# EAGLE design ASM2026 (EAGLE 6.3)
DATABASE: ./../../../../../Components/TinyCircuits_Part_Database.txt
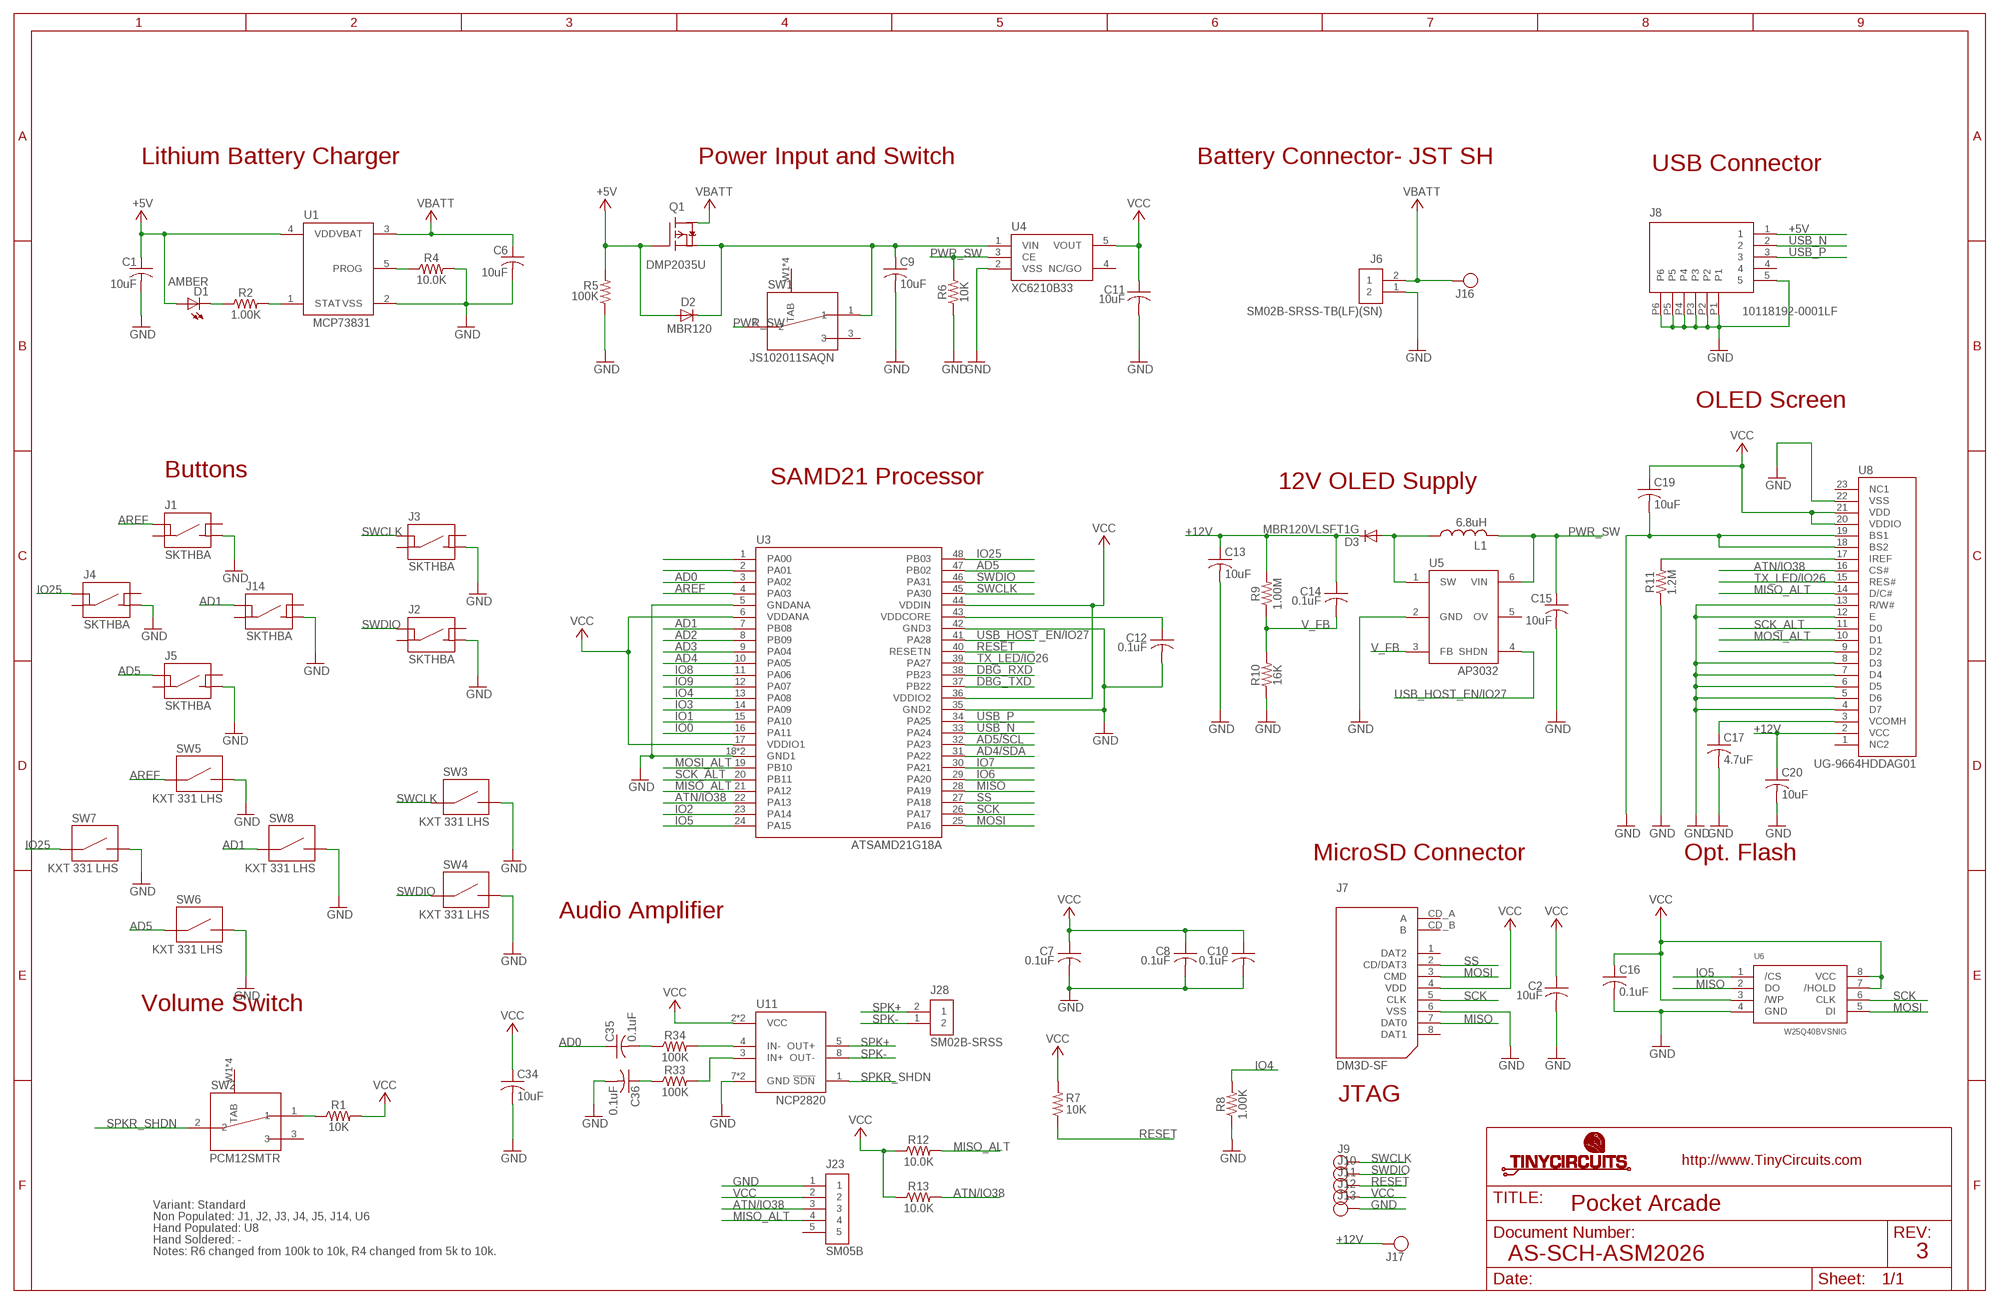
[diagram p0: schematic, sheet 1]

## Parts
C1  10uF  AS-ITM-00002  [C0603]
C2  10uF  AS-ITM-00002  [C0603]
C6  10uF  AS-ITM-00002  [C0603]
C7  0.1uF  AS-ITM-00008  [C0402]
C8  0.1uF  AS-ITM-00008  [C0402]
C9  10uF  AS-ITM-00002  [C0603]
C10  0.1uF  AS-ITM-00008  [C0402]
C11  10uF  AS-ITM-00002  [C0603]
C12  0.1uF  AS-ITM-00008  [C0402]
C13  10uF  AS-ITM-00045  [C0805]
C14  0.1uF  AS-ITM-00008  [C0402]
C15  10uF  AS-ITM-00002  [C0603]
C16  0.1uF  AS-ITM-00008  [C0402]
C17  4.7uF  AS-ITM-00232  [1206_CAP_TANT]
C19  10uF  AS-ITM-00002  [C0603]
C20  10uF  AS-ITM-00045  [C0805]
C34  10uF  AS-ITM-00002  [C0603]
C35  0.1uF  AS-ITM-00008  [C0402]
C36  0.1uF  AS-ITM-00008  [C0402]
D1  AMBER  AS-ITM-00026  [LNJ_LED]
D2  MBR120  AS-ITM-00111  [SOD-123FL]
D3  MBR120VLSFT1G  AS-ITM-00111  [SOD-123FL]
J1  SKTHBA  AS-ITM-00369  [SKTHBA_TACT]
J2  SKTHBA  AS-ITM-00369  [SKTHBA_TACT]
J3  SKTHBA  AS-ITM-00369  [SKTHBA_TACT]
J4  SKTHBA  AS-ITM-00369  [SKTHBA_TACT]
J5  SKTHBA  AS-ITM-00369  [SKTHBA_TACT]
J6  SM02B-SRSS-TB(LF)(SN)  AS-ITM-00231  [JST_SH_2X1]
J7  DM3D-SF  AS-ITM-00047  [SD_CARD]
J8  10118192-0001LF  AS-ITM-00021A  [MICRO_USB_ALT]
J9  TEST_POINT  [TEST_POINT_1MM]
J10  TEST_POINT  [TEST_POINT_1MM]
J11  TEST_POINT  [TEST_POINT_1MM]
J12  TEST_POINT  [TEST_POINT_1MM]
J13  TEST_POINT  [TEST_POINT_1MM]
J14  SKTHBA  AS-ITM-00369  [SKTHBA_TACT]
J16  TEST_POINT  [TEST_POINT_1MM]
J17  TEST_POINT  [TEST_POINT_1MM]
J23  SM05B  AS-ITM-00340  [JST_SH_5X1]
J28  SM02B-SRSS  AS-ITM-00231  [JST_SH_2X1]
L1  6.8uH  AS-ITM-00320  [R0805]
Q1  DMP2035U  AS-ITM-00024A  [SOT23A]
R1  10K  AS-ITM-00032  [0402]
R2  1.00K  AS-ITM-00003  [0402]
R4  10.0K  AS-ITM-00032  [0402]
R5  100K  AS-ITM-00004  [0402]
R6  10K  AS-ITM-00032  [0402]
R7  10K  AS-ITM-00032  [0402]
R8  1.00K  AS-ITM-00003  [0402]
R9  1.00M  AS-ITM-00005  [0402]
R10  16K  AS-ITM-00314  [0402]
R11  1.2M  AS-ITM-00280  [0402]
R12  10.0K  AS-ITM-00032  [0402]
R13  10.0K  AS-ITM-00032  [0402]
R33  100K  AS-ITM-00004  [0402]
R34  100K  AS-ITM-00004  [0402]
SW1  JS102011SAQN  AS-ITM-00220  [PCM12SMTR]
SW2  PCM12SMTR  AS-ITM-00220  [PCM12SMTR]
SW3  KXT 331 LHS  AS-ITM-003721  [KXT_LHS_1]
SW4  KXT 331 LHS  AS-ITM-003721  [KXT_LHS_1]
SW5  KXT 331 LHS  AS-ITM-003721  [KXT_LHS_1]
SW6  KXT 331 LHS  AS-ITM-003721  [KXT_LHS_1]
SW7  KXT 331 LHS  AS-ITM-003721  [KXT_LHS_1]
SW8  KXT 331 LHS  AS-ITM-003721  [KXT_LHS_1]
U1  MCP73831  AS-ITM-00136  [SOT-23]
U3  ATSAMD21G18A  AS-ITM-00273  [QFN48]
U4  XC6210B33  AS-ITM-00046  [SOT-25]
U5  AP3032  AS-ITM-00310  [SOT-23-6]
U6  W25Q40BVSNIG  AS-ITM-00238  [8-SOIC-N]
U8  UG-9664HDDAG01  AS-ITM-00158FLIPPED  [OLED_DISPLAY]
U11  NCP2820  AS-ITM-00370  [WSON-8]

## Nets
+5V: C1.1 D1.A D2.A J8.1 Q1.B(G) R5.2 U1.4(VDD)
+12V: C13.1 C14.1 C20.1 D3.C J17.P$1 R9.2 U8.2(VCC)
AD0: C35.1 U3.3(PA02)
AD1: J14.1 SW8.1 U3.7(PB08)
AD2: U3.8(PB09)
AD3: U3.9(PA04)
AD4: U3.10(PA05)
AD4/SDA: U3.31(PA22)
AD5: J5.1 SW6.1 U3.47(PB02)
AD5/SCL: U3.32(PA23)
AREF: J1.1 SW5.1 U3.4(PA03)
ATN/IO38: J23.3 R13.2 U3.22(PA13) U8.16(CS#)
DBG_RXD: U3.38(PB23)
DBG_TXD: U3.37(PB22)
GND: C1.2 C2.2 C6.2 C7.2 C8.2 C9.2 C10.2 C11.2 C12.2 C13.2 C15.2 C16.2 C17.2 C19.2 C20.2 C34.2 C36.2 J1.4 J2.4 J3.4 J4.4 J5.4 J6.1 J7.6(VSS) J8.5 J8.P1 J8.P2 J8.P3 J8.P4 J8.P5 J8.P6 J13.P$1 J14.4 J23.1 R4.2 R5.1 R6.1 R8.1 R10.1 R11.1 SW3.2 SW4.2 SW5.2 SW6.2 SW7.2 SW8.2 U1.2(VSS) U3.5(GNDANA) U3.18(GND1) U3.35(GND2) U3.42(GND3) U3.EXP(GND1) U4.2(VSS) U5.2(GND) U6.4(GND) U8.4(D7) U8.5(D6) U8.6(D5) U8.7(D4) U8.8(D3) U8.12(E) U8.13(R/W#) U8.18(BS2) U8.19(BS1) U8.22(VSS) U11.7(GND) U11.9(GND)
IO0: U3.16(PA11)
IO1: U3.15(PA10)
IO2: U3.23(PA14)
IO3: U3.14(PA09)
IO4: R8.2 U3.13(PA08)
IO5: U3.24(PA15) U6.1(/CS)
IO6: U3.29(PA20)
IO7: U3.30(PA21)
IO8: U3.11(PA06)
IO9: U3.12(PA07)
IO25: J4.1 SW7.1 U3.48(PB03)
MISO: J7.7(DAT0) U3.28(PA19) U6.2(DO)
MISO_ALT: J23.4 R12.2 U3.21(PA12) U8.14(D/C#)
MOSI: J7.3(CMD) U3.25(PA16) U6.5(DI)
MOSI_ALT: U3.19(PB10) U8.10(D1)
N$1: U3.1(PA00)
N$2: R1.1 SW2.1
N$3: U3.2(PA01)
N$5: D1.C R2.1
N$6: R4.1 U1.5(PROG)
N$7: R2.2 U1.1(STAT)
N$8: C12.1 U3.43(VDDCORE)
N$9: R11.2 U8.17(IREF)
N$12: C17.1 U8.3(VCOMH)
N$15: U8.9(D2)
N$19: D3.A L1.1 U5.1(SW)
N$46: R33.2 U11.3(IN+)
N$47: R34.2 U11.4(IN-)
N$48: C35.2 R34.1
N$49: C36.1 R33.1
PWR_SW: C15.1 L1.2 R6.2 SW1.2 U4.3(CE) U5.6(VIN)
PWR_SWITCH: C9.1 D2.C Q1.E(S) SW1.1 U4.1(VIN)
RESET: J11.P$1 R7.1 U3.40(RESETN)
SCK: J7.5(CLK) U3.26(PA17) U6.6(CLK)
SCK_ALT: U3.20(PB11) U8.11(D0)
SPK+: J28.2 U11.5(OUT+)
SPK-: J28.1 U11.8(OUT-)
SPKR_SHDN: SW2.2 U11.1(!SDN)
SS: J7.2(CD/DAT3) U3.27(PA18)
SWCLK: J3.1 J9.P$1 SW3.1 U3.45(PA30)
SWDIO: J2.1 J10.P$1 SW4.1 U3.46(PA31)
TX_LED/IO26: U3.39(PA27) U8.15(RES#)
USB_HOST_EN/IO27: U3.41(PA28) U5.4(SHDN)
USB_N: J8.2 U3.33(PA24)
USB_P: J8.3 U3.34(PA25)
V_FB: C14.2 R9.1 R10.2 U5.3(FB)
VBATT: C6.1 J6.2 J16.P$1 Q1.C(D) U1.3(VBAT)
VCC: C2.1 C7.1 C8.1 C10.1 C11.1 C16.1 C19.1 C34.1 J7.4(VDD) J12.P$1 J23.2 R1.2 R7.2 R12.1 R13.1 U3.6(VDDANA) U3.17(VDDIO1) U3.36(VDDIO2) U3.44(VDDIN) U4.5(VOUT) U6.3(/WP) U6.7(/HOLD) U6.8(VCC) U8.20(VDDIO) U8.21(VDD) U11.2(VCC) U11.6(VCC)
Unconnected: J1.2 J1.3 J2.2 J2.3 J3.2 J3.3 J4.2 J4.3 J5.2 J5.3 J7.1(DAT2) J7.8(DAT1) J7.CD_A(A) J7.CD_B(B) J8.4 J14.2 J14.3 J23.5 SW1.3 SW1.W1(TAB) SW1.W2(TAB) SW1.W3(TAB) SW1.W4(TAB) SW2.3 SW2.W1(TAB) SW2.W2(TAB) SW2.W3(TAB) SW2.W4(TAB) U4.4(NC/GO) U5.5(OV) U8.1(NC2) U8.23(NC1)

## Notes on the sheet
- Lithium Battery Charger | Power Input and Switch | Battery Connector- JST SH
- USB Connector
- OLED Screen
- Buttons
- SAMD21 Processor | 12V OLED Supply
- MicroSD Connector | Opt. Flash
- Audio Amplifier
- Volume Switch
- JTAG
- Variant: Standard | Pocket Arcade
- Non Populated: J1, J2, J3, J4, J5, J14, U6
- Hand Populated: U8
- Hand Soldered: -
- Notes: R6 changed from 100k to 10k, R4 changed from 5k to 10k.
- AS-SCH-ASM2026 | 3

## Library data of the parts
C1 C2 C6 C9 C11 C15 C19 C34 = tinycircuits:AS-ITM-00002: CAP CER 10UF 10V 20% X5R 0603; PARTNO: AS-ITM-00002
C7 C8 C10 C12 C14 C16 C35 C36 = tinycircuits:AS-ITM-00008: CAP CER 0.1UF 16V 10% X5R 0402; PARTNO: AS-ITM-00008
C13 C20 = tinycircuits:AS-ITM-00045: CAP CER 16UF 16V 20% X5R 0805; PARTNO: AS-ITM-00045
C17 = tinycircuits:AS-ITM-00232: CAP TANT 4.7UF 20V 20% 1206; PARTNO: AS-ITM-00232; PNPROTATION: 180; VALUE: F931D475MAA
D1 = tinycircuits:AS-ITM-00026: LED AMBER SIDE VIEW SMD; PARTNO: AS-ITM-00026; PNPROTATION: 90
D2 = tinycircuits:AS-ITM-00111: DIODE SCHOTTKY 20V 1A SOD123L; PARTNO: AS-ITM-00111; PNPROTATION: 0; VALUE: MBR120VLSFT1G
D3 = tinycircuits:AS-ITM-00111: DIODE SCHOTTKY 20V 1A SOD123L; PARTNO: AS-ITM-00111; PNPROTATION: 0
J1-J5 J14 = tinycircuits:AS-ITM-00369: SKTHBA-Tact Momentary Switch 3.2mm x 3.5mm Datasheet: http://www.alps.com/prod/info/E/HTML/Tact/SurfaceMount/SKTH/SKTHBAE010.html; PARTNO: AS-ITM-00369
J6 = tinycircuits:AS-ITM-00231: CONN HEADER SH 2POS SIDE 1MM; PARTNO: AS-ITM-00231; PNPROTATION: 180
J7 = tinycircuits:AS-ITM-00047: CONN MICRO SD R/A PUSH-PULL SMD; PARTNO: AS-ITM-00047; PNPROTATION: 270
J8 = tinycircuits:AS-ITM-00021: CONN RCPT 5POS MICRO USB R/A; PARTNO: AS-ITM-00021; PNPROTATION: 90
J9-J13 J16 J17 = tinycircuits:TEST_POINT: Test point, no drill
J23 = tinycircuits:AS-ITM-00340: CONN HEADER SH 5POS SIDE 1MM TIN; PARTNO: AS-ITM-00340; PNPROTATION: 180
J28 = tinycircuits:AS-ITM-00231: CONN HEADER SH 2POS SIDE 1MM; PARTNO: AS-ITM-00231; PNPROTATION: 180; VALUE: SM02B-SRSS-TB(LF)(SN)
L1 = tinycircuits:AS-ITM-00320: 6.8µH Shielded Multilayer Inductor 350mA 520 mOhm Max 0805; PARTNO: AS-ITM-00320
Q1 = tinycircuits:AS-ITM-00024: P-Channel MOSFET SOT-23; PARTNO: AS-ITM-00024; PNPROTATION: 0
R1 R6 R7 = tinycircuits:AS-ITM-00032: RES 10.0K OHM 1/16W 1% 0402 SMD; PARTNO: AS-ITM-00032; VALUE: 10.0K
R2 R8 = tinycircuits:AS-ITM-00003: RES 1.00K OHM 1/16W 1% 0402; PARTNO: AS-ITM-00003
R4 R12 R13 = tinycircuits:AS-ITM-00032: RES 10.0K OHM 1/16W 1% 0402 SMD; PARTNO: AS-ITM-00032
R5 R33 R34 = tinycircuits:AS-ITM-00004: RES 100K OHM 1/16W 1% 0402; PARTNO: AS-ITM-00004
R9 = tinycircuits:AS-ITM-00005: RES 1.00M OHM 1/16W 1% 0402; PARTNO: AS-ITM-00005
R10 = tinycircuits:AS-ITM-00314: RES SMD 16K OHM 1% 1/16W 0402; PARTNO: AS-ITM-00314
R11 = tinycircuits:AS-ITM-00280: RES SMD 1.2M OHM 1% 1/16W 0402; PARTNO: AS-ITM-00280
SW1 = tinycircuits:AS-ITM-00220: SW SLIDE SP2T 6VDC 0.3A SMT; PARTNO: AS-ITM-00220; PNPROTATION: 0; VALUE: PCM12SMTR
SW2 = tinycircuits:AS-ITM-00220: SW SLIDE SP2T 6VDC 0.3A SMT; PARTNO: AS-ITM-00220; PNPROTATION: 0
SW3-SW8 = tinycircuits:AS-ITM-00372: SWITCH TACTILE SPST-NO 0.02A 15V; PARTNO: AS-ITM-00372
U1 = tinycircuits:AS-ITM-00136: IC CONTROLLER LI-ION 4.2V SOT23-5; PARTNO: AS-ITM-00136; PNPROTATION: 270
U3 = tinycircuits:AS-ITM-00273: IC MCU 32BIT 256KB FLASH 48QFN; PARTNO: AS-ITM-00273; PNPROTATION: 270
U4 = tinycircuits:AS-ITM-00046: IC REG LDO 3.3V .7A SOT-25; PARTNO: AS-ITM-00046; PNPROTATION: 270
U5 = tinycircuits:AS-ITM-00310: LED Driver IC 1 Output DC DC Regulator Step-Up (Boost); PARTNO: AS-ITM-00310; PNPROTATION: 270
U6 = tinycircuits:AS-ITM-00238: SOIC 150MIL 4MBIT SERIAL FLASH SPI; PARTNO: AS-ITM-00238; PNPROTATION: 90
U8 = tinycircuits:AS-ITM-00158: 0.96" OLED Display; PARTNO: AS-ITM-00158
U11 = tinycircuits:AS-ITM-00370: IC PWR AMP AUD 2.65W D 8UDFN; PARTNO: AS-ITM-00370; PNPROTATION: 90

## Board
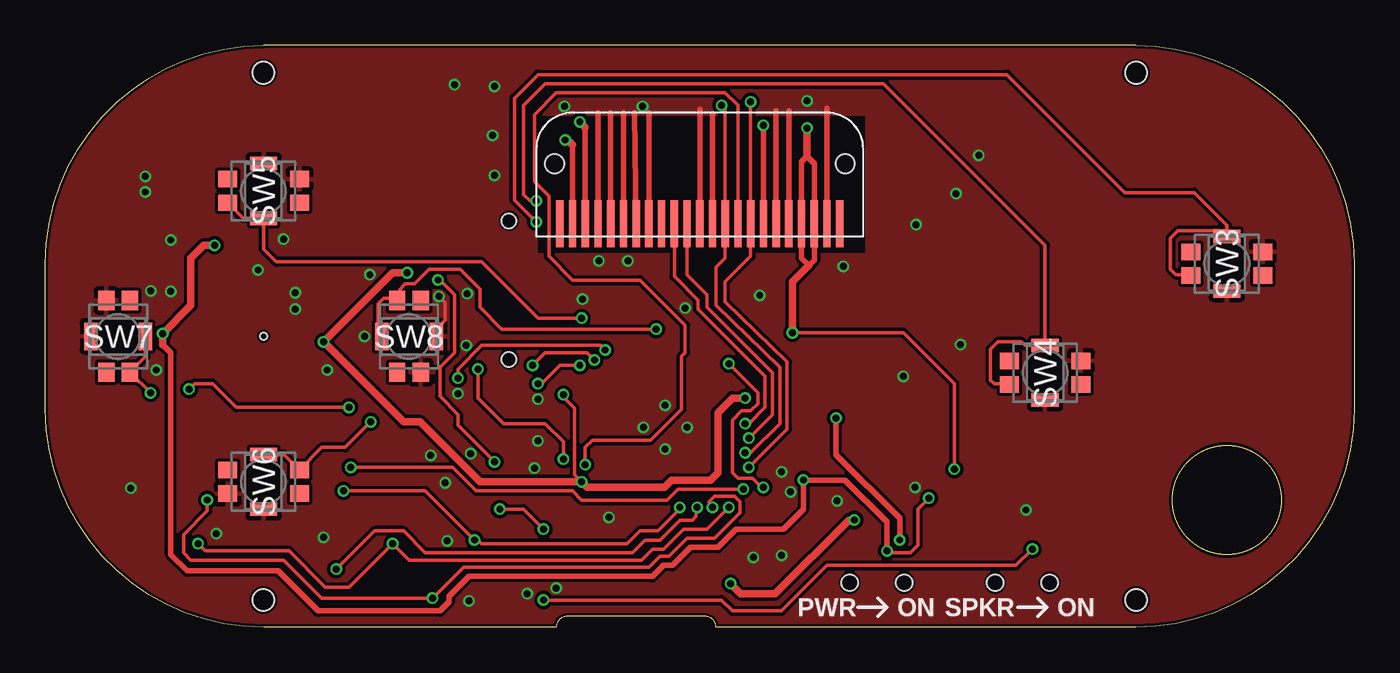
[diagram p1: board, top side]
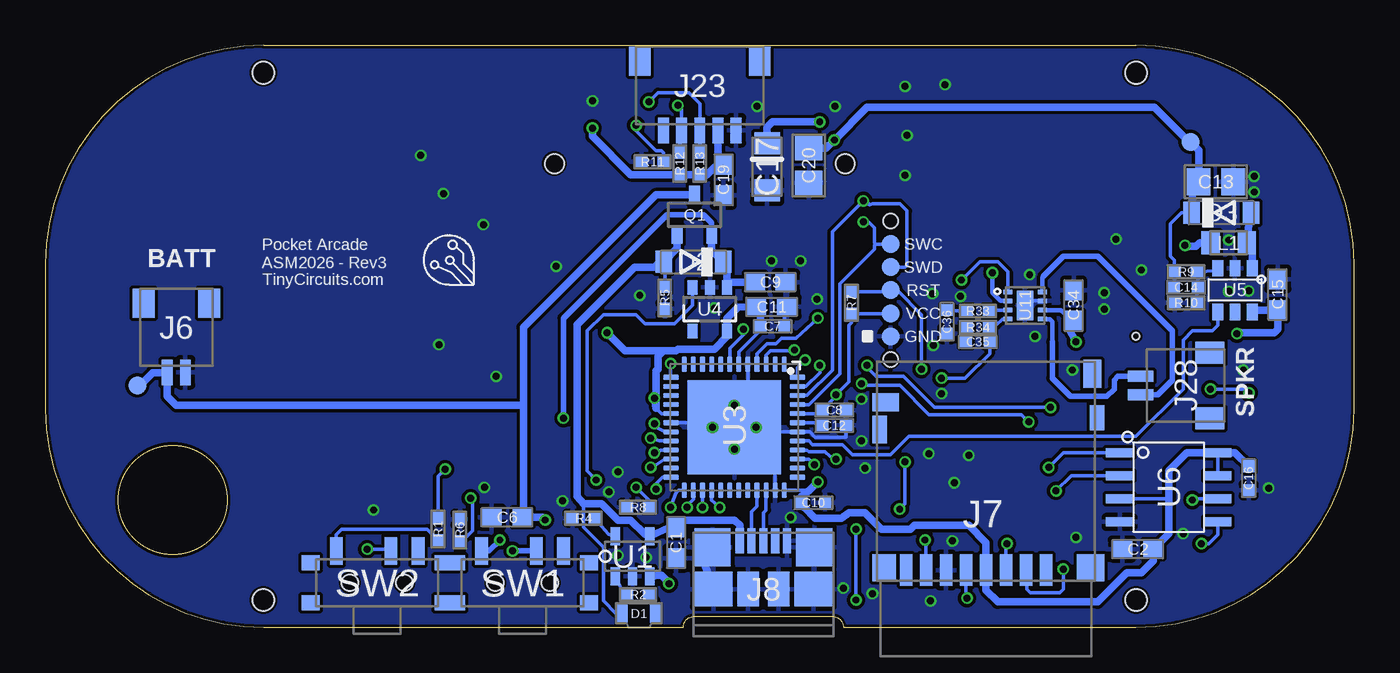
[diagram p2: board, bottom side, seen from below]

Size 72 x 32 mm. Coordinates in mm from the lower left corner, seen from the top.
Outline: 72,20 72,12 arc-90 60,0 36.9,0 arc90 36.3,0.6 28.7,0.6 arc90 28.1,0 12,0 arc-90 0,12 0,20 arc-90 12,32 60,32 arc-90 72,20
Outline: circle at 65,7 radius 3
Copper layers (1*16): Top 0.035mm / dielectric 1.5mm / Bottom 0.035mm
Design rules "default *": minimum track width 8mil, minimum drill 15mil, track to track 7mil, track to pad 7mil, pad to pad 7mil, via to via 7mil, smd to smd 7mil, copper to edge 6mil, drill to drill 8mil, minimum pad ring 8mil, minimum via ring 5mil, stop-mask expansion 4mil, vias tented up to drill 25mil, thermal gap 10mil
Holes 0.8 mm at 25.5,14.73 25.5,22.35
Holes 1.2 mm at 12,1.5 12,30.5 60,1.5 60,30.5
Holes 0.4 mm at 12,16
tRestrict: area 27.1,20.6 to 45.1,28.1; area 64,18.5 to 66,21.5; area 54,12.5 to 56,15.5; area 11,6.5 to 13,9.5; area 18.5,15 to 21.5,17; area 2.5,15 to 5.5,17; area 11,22.5 to 13,25.5

### Footprints (pad centres in the part's own frame; a part is rotated, then mirrored left to right if it is on the bottom)
C0603 = smd 1.1 x 1: 1 -0.85,0; 2 0.85,0
C0402 = smd 0.65 x 0.6: 1 -0.65,0; 2 0.65,0
C0805 = smd 1.3 x 1.5: 1 -0.95,0; 2 0.95,0
1206_CAP_TANT = smd 1.2 x 1.4: 1 -1.3,0; 2 1.3,0
LNJ_LED = smd 1 x 0.55: A 0,0.9; C 0,-0.9
SOD-123FL = smd 0.914 x 1.219: A 1.638,0; C -1.638,0
SKTHBA_TACT = smd 1.05 x 0.9: 1 -1.975,-0.65; 2 1.975,-0.65; 3 -1.975,0.65; 4 1.975,0.65
JST_SH_2X1 = smd 0.6 x 1.4: 1 -0.5,2.475; 2 0.5,2.475 | smd 1.2 x 1.6: PAD1 -1.8,-1.325; PAD2 1.8,-1.325
SD_CARD = smd 0.7 x 1.75: 1 3.3,0; 2 2.2,0; 3 1.1,0; 4 0,0; 5 -1.1,0; 6 -2.2,0; 7 -3.3,0; 8 -4.4,0 | smd 1.3 x 1.5: 9 -5.6,0.125 | smd 1.5 x 1.5: 10 5.75,0.125 | smd 0.8 x 1.5: 11 -5.85,7.725 | smd 0.8 x 1.4: 13 6.1,8.375 | smd 1 x 1.55: CD_A 5.85,10.8 | smd 1.45 x 1: CD_B -5.525,9.225
MICRO_USB_ALT = smd 1.38 x 0.45: 1 2.66,1.3; 2 2.66,0.65; 3 2.66,0; 4 2.66,-0.65; 5 2.66,-1.3 | smd 2.1 x 2: P1 2.3,-2.8; P2 2.3,2.8 | smd 1.9 x 2.1: P3 0,2.75; P4 0,-2.75 | smd 1.9 x 1.175: P5 0,0.838; P6 0,-0.838
TEST_POINT_1MM = smd 1 x 1: P$1 0,0
JST_SH_5X1 = smd 0.6 x 1.4: 1 -2,2.475; 2 -1,2.475; 3 0,2.475; 4 1,2.475; 5 2,2.475 | smd 1.2 x 1.6: PAD1 -3.3,-1.325; PAD2 3.3,-1.325
R0805 = smd 1 x 1.25: 1 -1,0; 2 1,0
SOT23A = smd 0.6 x 1: B -0.95,-1.1; C 0,1.1; E 0.95,-1.1
0402 = smd 0.65 x 0.55: 1 -0.6,0; 2 0.6,0
PCM12SMTR = smd 0.7 x 1.5: 1 -2.25,1.75; 2 0.75,1.75; 3 2.25,1.75 | smd 1 x 0.8: W1 -3.65,1.1; W2 -3.65,-1.1; W3 3.65,-1.1; W4 3.65,1.1 | hole 0.9: 1.5,0; -1.5,0
KXT_LHS_1 = smd 1.5 x 0.75: 1 0,1.5; 2 0,-1.5
SOT-23 = smd 0.5 x 1: 1 -0.95,-1.1; 2 0,-1.1; 3 0.95,-1.1; 4 0.95,1.1; 5 -0.95,1.1
QFN48 = smd 0.85 x 0.28: 1 -3.475,2.75; 2 -3.475,2.25; 3 -3.475,1.75; 4 -3.475,1.25; 5 -3.475,0.75; 6 -3.475,0.25; 7 -3.475,-0.25; 8 -3.475,-0.75; 9 -3.475,-1.25; 10 -3.475,-1.75; 11 -3.475,-2.25; 12 -3.475,-2.75; 25 3.475,-2.75; 26 3.475,-2.25; 27 3.475,-1.75; 28 3.475,-1.25; 29 3.475,-0.75; 30 3.475,-0.25; 31 3.475,0.25; 32 3.475,0.75; 33 3.475,1.25; 34 3.475,1.75; 35 3.475,2.25; 36 3.475,2.75 | smd 0.28 x 0.85: 13 -2.75,-3.475; 14 -2.25,-3.475; 15 -1.75,-3.475; 16 -1.25,-3.475; 17 -0.75,-3.475; 18 -0.25,-3.475; 19 0.25,-3.475; 20 0.75,-3.475; 21 1.25,-3.475; 22 1.75,-3.475; 23 2.25,-3.475; 24 2.75,-3.475; 37 2.75,3.475; 38 2.25,3.475; 39 1.75,3.475; 40 1.25,3.475; 41 0.75,3.475; 42 0.25,3.475; 43 -0.25,3.475; 44 -0.75,3.475; 45 -1.25,3.475; 46 -1.75,3.475; 47 -2.25,3.475; 48 -2.75,3.475 | smd 5.15 x 5.15: EXP 0,0
SOT-25 = smd 0.55 x 0.8: 1 -0.95,-1.2; 2 0,-1.2; 3 0.95,-1.2; 4 0.95,1.2; 5 -0.95,1.2
SOT-23-6 = smd 0.6 x 0.9: 1 -0.95,-1.2; 2 0,-1.2; 3 0.95,-1.2; 4 0.95,1.2; 5 0,1.2; 6 -0.95,1.2
8-SOIC-N = smd 0.5 x 1.5: 1 -1.905,-2.7; 2 -0.635,-2.7; 3 0.635,-2.7; 4 1.905,-2.7; 5 1.905,2.7; 6 0.635,2.7; 7 -0.635,2.7; 8 -1.905,2.7
OLED_DISPLAY = smd 0.4 x 2.6: 1 -7.7,0.2; 2 -7,0.2; 3 -6.3,0.2; 4 -5.6,0.2; 5 -4.9,0.2; 6 -4.2,0.2; 7 -3.5,0.2; 8 -2.8,0.2; 9 -2.1,0.2; 10 -1.4,0.2; 11 -0.7,0.2; 12 0,0.2; 13 0.7,0.2; 14 1.4,0.2; 15 2.1,0.2; 16 2.8,0.2; 17 3.5,0.2; 18 4.2,0.2; 19 4.9,0.2; 20 5.6,0.2; 21 6.3,0.2; 22 7,0.2; 23 7.7,0.2 | hole 1.05: 8,3.5; -8,3.5
WSON-8 = smd 0.25 x 0.5: 1 -0.75,-0.95; 2 -0.25,-0.95; 3 0.25,-0.95; 4 0.75,-0.95; 5 0.75,0.95; 6 0.25,0.95; 7 -0.25,0.95; 8 -0.75,0.95 | smd 1.6 x 0.9: 9 0,0

### Placement (x,y rotation side)
C1  37.31,4.65 270 bottom
C2  11.9,4.3 180 bottom
C6  46.6,6.05 180 bottom
C7  32,16.55 0 bottom
C8  28.6,11.95 0 bottom
C9  32.12,18.99 0 bottom
C10  29.75,6.85 0 bottom
C11  32.05,17.62 0 bottom
C12  28.6,11.1 0 bottom
C13  7.6,24.5 0 bottom
C14  9.25,18.7 0 bottom
C15  4.2,18.3 90 bottom
C16  5.8,8.2 270 bottom
C17  32.3,25.33 270 bottom
C19  34.7,24.6 270 bottom
C20  30,25.4 270 bottom
C34  15.43,17.7 90 bottom
C35  20.7,15.7 180 bottom
C36  22.4,16.8 270 bottom
D1  39.35,0.75 90 bottom
D2  36.34,20.1 180 bottom
D3  7.3,22.8 0 bottom
J1  12,24 0 top
J2  55,14 0 top
J3  65,20 0 top
J4  4,16 90 top
J5  12,8 180 top
J6  64.8,16.5 180 bottom
J7  20.25,3.15 0 bottom
J8  32.5,2.1 90 bottom
J9  25.5,21.08 0 bottom
J10  25.5,19.81 0 bottom
J11  25.5,18.54 0 bottom
J12  25.5,17.27 0 bottom
J13  25.5,16 0 bottom
J14  20,16 270 top
J16  66.95,13.3 0 bottom
J17  9,26.7 0 bottom
J23  36,29.8 180 bottom
J28  9.27,13.3 90 bottom
L1  6.9,21.15 180 bottom
Q1  36.29,22.68 0 bottom
R1  50.4,5.4 90 bottom
R2  39.4,1.8 180 bottom
R4  42.4,6 180 bottom
R5  37.92,18.12 90 bottom
R6  49.2,5.35 270 bottom
R7  27.65,17.85 270 bottom
R8  39.4,6.6 0 bottom
R9  9.25,19.55 180 bottom
R10  9.25,17.85 0 bottom
R11  38.6,25.6 0 bottom
R12  37.1,25.5 90 bottom
R13  36,25.5 90 bottom
R33  20.7,17.4 0 bottom
R34  20.7,16.5 0 bottom
SW1  45.75,2.45 0 bottom
SW2  53.75,2.45 0 bottom
SW3  65,20 0 top
SW4  55,14 0 top
SW5  12,24 180 top
SW6  12,8 0 top
SW7  4,16 270 top
SW8  20,16 90 top
U1  39.7,3.9 0 bottom
U3  34.1,11 270 bottom
U4  35.45,17.5 180 bottom
U5  6.55,18.55 180 bottom
U6  10.2,7.7 270 bottom
U8  36,22 0 top
U11  18.1,17.7 270 bottom
U$1  [DOCFIELD-TINYCIRCUITS-PCB]  88,-5 0 top  (outside the outline)

### Tracks (layer width: path | path; a pad name or v marks a point on that pad's centre or on a via)
+5V
  Bottom 0.203: 38.5,5.06 U1.4 | D1.A 40.6,0.75 41.3,1.45 41.3,4.4 42.4,5.5 42.4,6.8 | R5.2 37.92,20.04 D2.A
  Bottom 0.406: J8.1 33.8,5.6 34.1,5.9 37,5.9 C1.1 37.66,5.5 U1.4 39.01,5.11 39.8,5.9 40.5,5.9 41.4,6.8 42.4,6.8 42.75,7.2 42.75,16.65 39.6,19.8 38.5,19.8 38.2,20.1 D2.A 37.24,20.84 Q1.B
+12V  (via drill 0.38)
  Top 0.305: U8.2 29,26.55
  Top 0.406: v28.6,26.8 28.75,26.8 29,26.55
  Bottom 0.203: C14.1 9.9,19.55 R9.2 9.9,19.6 9.9,20.2 10.1,20.4 10.1,22.2 9.5,22.8 D3.C
  Bottom 0.254: C13.1 8.15,24.3 8.75,24.65 8.5,24.75 8.5,24.95 8.55,25.05
  Bottom 0.406: D3.C 8.9,23.1 8.9,23.75 C13.1 | 8.55,25.05 8.55,26.25 J17.P$1 9.1,26.7 11,28.6 26.8,28.6 v28.6,26.8 29.05,26.35 C20.1
AD0  (via drill 0.38)
  Top 0.203: v30.8,15.25 30.55,15.5 24,15.5 22.7,14.2 v22.7,13.7
  Bottom 0.203: U3.3 32.35,14.95 32.1,15.2 30.9,15.2 v30.8,15.25 | C35.1 20.05,15.05 21.4,13.7 v22.7,13.7
AD1  (via drill 0.38)
  Top 0.203: v33.6,16.4 25.1,16.4 23.9,17.6 23.9,18.6 22.8,19.7 21.1,19.7 20.3,18.9 19.8,18.9 19.5,18.6 19.5,18.12 J14.1 19.23,18.1 18.6,18.1 18.3,17.8 18.3,16.6 18.5,16.4 SW8.1
  Bottom 0.203: U3.7 34.35,15.35 33.6,16.1 v33.6,16.4
AD5  (via drill 0.38)
  Top 0.203: v29.4,14.4 28.3,14.4 27.3,13.4 v27.1,13.4 | SW6.1 13.12,9.5 J5.1 13.98,8.68 15.2,9.9 16.5,9.9 v17.9,11.3
  Bottom 0.203: U3.47 30.15,13.25 29.4,14 v29.4,14.4 | v27.1,13.4 27,13.3 25,13.3 23.4,11.7 18.3,11.7 v17.9,11.3
AREF  (via drill 0.38)
  Top 0.203: J1.1 10.88,22.5 SW5.1 12,20.8 12.7,20.1 24,20.1 27.1,17 v29.5,17
  Bottom 0.203: U3.4 32.85,15.05 32.3,15.6 31.8,15.6 31.5,15.9 30.7,15.9 v29.5,17
ATN/IO38  (via drill 0.38)
  Top 0.203: v38.7,8.8 40.8,10.9 40.8,14.6 37.4,17.9 37.4,19 38.8,20.4 38.8,20.9 38.9,21 38.9,22.1 U8.16 v38.8,28.9
  Bottom 0.203: U3.22 37.95,9.25 38.6,8.8 v38.7,8.8 | v38.8,28.9 38.3,29.4 36.6,29.4 36,28.8 J23.3 R13.2
GND  (via drill 0.38)
  Top 0.203: SW8.2 21.5,16.4 22,16.9 22,17.85 v21.65,18.2
  Top 0.305: U8.22 43,28.55 | U8.19 40.9,28.4 | U8.18 40.2,28.4 | U8.13 36.7,28.25 | U8.8 33.2,28.3 | U8.7 32.4,28.3 | U8.6 31.8,28.3 | U8.5 31.1,28.3 | U8.4 30.4,28.3 | U8.12 36,28.5
  Bottom 0.203: C12.2 27.95,10.45 29.65,10.45 29.95,10.75 U3.42 32.75,10.75 v32.9,11 31.85,9.85 U3.35 | U3.18 35.9,11.25 | 35.9,11.25 35.85,12 | 34.1,12.15 33.35,12.9 U3.5 | C7.2 31.35,17.38 C11.2 | 35.9,11.25 35.65,11 34.75,11 | U11.7 17.85,17.95 U11.9
  Bottom 0.406: J8.P3 35.91,3.95 J8.P2
  other vias: 34.1,9.8 27.1,12.55 5.5,24.8 6.9,18.48 5.5,23.94 53.95,6.45 51.35,25.95 47.9,22.15 40.5,3.95 38.95,3.85 5.8,18.5 50.1,23.85 35.2,17.55 6.9,21.3 47.85,7.7 43.55,6.95 50.35,15.55 32.05,20.15 47.2,13.8 15.5,14.15 23.2,18.35 23.15,15.5 17.55,16 17.85,19.4 13.75,18.4 22.1,4.75 23.3,1.45 30.45,20.15 13.75,17.5 39.3,18.25 28.55,28.65 41,7.45 40.5,8.55 26.9,8.75 23.4,9.55 21.2,9.45 22,7.95 31,6.05 28.1,2.15 43.9,19.85 24.6,27.05 24.7,24.85 24.7,29.75 22.5,29.85 32.85,28.65 41.9,28.95 35.3,11 34.1,12.2 26.5,1.85 9.4,5.15 15.3,4.95 4.7,7.65 6.1,14.15 13.1,21.35 11.7,19.65 29.55,18.05 27.1,10.25 22.7,12.85
  pour Top: 0,32 72,32 72,0 0,0
  pour Bottom: 0,32 72,32 72,0 0,0
IO4  (via drill 0.38)
  Top 0.203: v39.5,7.7 39.4,7.7 38.9,8.2 38.1,8.2 37.8,8.5 37.8,11.4 38.3,11.9 38.8,11.9 39.2,12.3 39.2,12.9 v37.6,14.5
  Bottom 0.203: U3.13 37.6,13.75 v37.6,14.5 | R8.2 38.8,7 v39.5,7.7
IO5  (via drill 0.38)
  Top 0.203: v16.8,8.8 22.4,8.8 23.7,7.5 29,7.5 29.5,7 34.2,7 34.8,7.6 v38.4,7.6
  Bottom 0.203: U3.24 38.05,8.25 38.4,7.9 v38.4,7.6 | U6.1 16,9.61 v16.8,8.8
IO25  (via drill 0.38)
  Top 0.203: v30.2,14.7 29.8,15.1 27.5,15.1 v26.8,14.4 | v5.79,12.89 J4.1 5.5,14.88 SW7.1 | v16.7,12.1 10.5,12.1 9.2,13.4 8.2,13.4 v7.9,13.1
  Bottom 0.203: U3.48 30.62,14.27 v30.2,14.7 | v26.8,14.4 26.8,14.3 26.3,13.8 24.8,13.8 23.1,12.1 v16.7,12.1 | v7.9,13.1 6,13.1 v5.79,12.89
MISO  (via drill 0.38)
  Top 0.203: v34.9,6.6 35,6.6 33.7,5.3 32.7,5.3 32,4.6 24,4.6 23.8,4.8 v23.6,4.8 20.9,7.5 v16.4,7.5
  Bottom 0.203: U3.28 35.35,7 v34.9,6.6 | v23.6,4.8 23.55,4.75 J7.7 | U6.2 15.57,8.34 v16.4,7.5
MISO_ALT  (via drill 0.38)
  Top 0.203: v38.5,9.6 38.8,9.6 40.4,11.2 40.4,14.3 36.9,17.7 36.9,19.8 37.4,20.3 U8.14 37.4,28.5 v37.2,28.7
  Bottom 0.203: U3.21 38.15,9.75 38.5,9.4 v38.5,9.6 | v37.2,28.7 37,28.5 J23.4 37.1,27.23 R12.2
MOSI  (via drill 0.38)
  Top 0.203: v37.6,6.6 36.4,5.4 35.1,5.4 34,4.3 33.4,4.3 32.8,3.7 20,3.7 v19.1,4.6 16.7,2.2 15.4,2.2 13.4,4.2 8.8,4.2 v8.4,4.6
  Bottom 0.203: U3.25 37.17,7.53 37.3,7.4 v37.6,6.6 | v8.4,4.6 8,4.6 7.5,5.1 U6.5 | J7.3 19.15,4.45 v19.1,4.6
MOSI_ALT  (via drill 0.38)
  Top 0.203: U8.10 34.6,19.3 35.9,18 35.9,17.5 39.6,13.8 39.6,12.1 38.7,11.2 v38.5,11.2
  Bottom 0.203: v38.5,11.2 38.5,11.1 38.4,11 37.9,10.75 U3.19
N$2
  Bottom 0.203: SW2.1 56,5.1 55.7,5.4 51,5.4 R1.1
N$5
  Bottom 0.203: D1.C 38.45,1.5 R2.1
N$6
  Bottom 0.203: U1.5 41.01,5.11 R4.1
N$7
  Bottom 0.203: U1.1 40.35,2.2 R2.2
N$8
  Bottom 0.203: C12.1 29.5,11.25 U3.43
N$9  (via drill 0.38)
  Top 0.305: U8.17 v39.5,27.6
  Bottom 0.203: v39.5,27.6 39.5,27.3 38.4,26.2 38.1,26.2 38,26.1 R11.2
N$12  (via drill 0.38)
  Top 0.305: U8.3 29.7,27.47
  Top 0.406: 29.7,27.47 29.7,27.5 v29.4,27.8
  Bottom 0.406: C17.1 32.3,27.5 32,27.8 v29.4,27.8
N$19
  Bottom 0.203: 5.6,21.02 L1.1 | 5.73,22.64 D3.A
  Bottom 0.406: U5.1 5.6,21.02 | L1.1 5.73,22.64
N$46
  Bottom 0.203: U11.3 20.05,17.45 R33.2
N$47
  Bottom 0.203: U11.4 19.35,16.95 19.7,16.6 20,16.6 R34.2
N$48
  Bottom 0.203: R34.1 21.3,15.75 C35.2
N$49
  Bottom 0.203: R33.1 22.35,17.4 C36.1
PWR_SW  (via drill 0.38)
  Top 0.203: v46.3,4.2 46.4,4.2 46.5,4.1 47.6,4.1 48,4.5 48,6.5 v48.6,7.1
  Top 0.305: 6.45,15.55 6.9,15.1 6.9,4 7.8,3.1 12.8,3.1 15,0.9 21.7,0.9 22.2,1.4 22.2,1.7 23.3,2.8 33.4,2.8 34,3.4 34.5,3.4 35.5,4.4 37,4.4 38,5.4 40.6,5.4 41.7,6.5 v41.7,8.1 44,8.1 46.3,5.8 v46.3,4.2
  Top 0.406: v9.3,21 8.7,21 8,20.3 8,17.7 v6.45,16.15 6.45,15.55
  Bottom 0.203: v41.7,8.1 42.2,8.6 42.2,16.3 41.3,17.2 39.5,17.2 39,16.7 37.4,16.7 36.4,17.7 U4.3 | 5.6,17.45 U5.6 | v48.6,7.1 48.6,6.9 48.5,6.8 48.5,5.3 49.05,4.75 R6.2
  Bottom 0.305: SW1.2 v46.3,4.2
  Bottom 0.406: v6.45,16.15 6.4,16.2 4.4,16.2 4.2,16.4 C15.1 5.6,17.45 | L1.2 8.5,21.15 8.7,20.95 9.25,20.95 v9.3,21
PWR_SWITCH  (via drill 0.38)
  Top 0.305: v47,4.8 47,6 43.5,9.5 v43.5,11.5
  Bottom 0.305: 35.34,20.74 35.34,22.24 35.8,22.7 37.8,22.7 43.5,17 v43.5,11.5 | SW1.1 47.6,4.2 v47,4.8
  Bottom 0.406: C9.1 34.49,18.99 | 34.49,18.99 U4.1 | 34.49,18.99 34.49,19.89 D2.C 35.34,20.74 Q1.E
RESET  (via drill 0.38)
  Top 0.203: v28.5,9.25 28.5,10.2 27.5,11.2 25.2,11.2 23.8,12.6 v23.8,14.2
  Bottom 0.203: v28.5,9.25 28.85,9.4 29.1,9.65 30,9.65 30.1,9.75 U3.40 | R7.1 25.59,18.45 J11.P$1 25.46,18.5 25.1,18.5 23.8,17.2 v23.8,14.2
SCK  (via drill 0.38)
  Top 0.203: v36.7,6.6 36.5,6.9 36.8,7.2 37.9,7.2 38.2,6.9 38.2,6.3 36.8,4.9 35.3,4.9 34.3,3.9 33.8,3.9 33.2,3.3 23,3.3 v21.3,1.6 15.2,1.6 13.1,3.7 8,3.7 7.6,4.1 7.6,5.1 8.9,6.4 v8.9,7
  Bottom 0.203: U3.26 36.35,7.05 36.7,6.7 v36.7,6.6 | v21.3,1.6 21.35,1.65 J7.5 | U6.6 8.84,7.06 v8.9,7
SCK_ALT  (via drill 0.38)
  Top 0.203: U8.11 35.3,19.4 36.4,18.3 36.4,17.6 40,14 40,11.7 v38.7,10.4
  Bottom 0.203: U3.20 38.25,10.25 v38.7,10.4
SPK+
  Bottom 0.254: U11.5 16.75,16.95 16.6,16.8 16.6,15.7
  Bottom 0.305: 16.6,15.7 16.6,13.7 15.6,12.7 13.6,12.7 13.2,13.1 13.2,13.6 13,13.8 J28.2
SPK-
  Bottom 0.254: U11.8 17.15,19.25 17.1,19.3
  Bottom 0.305: J28.1 10.8,12.8 10,13.6 10,16.3 14.1,20.4 16,20.4 17.1,19.3
SPKR_SHDN  (via drill 0.38)
  Top 0.203: v21.6,19.1 21.7,19.1 22.5,18.3 22.5,15.1 21.7,14.3 21.7,12.7 22.7,11.7 22.7,11.1 v24.7,9.1 | v25,6.5 26.3,6.5 v27.4,5.4 | v27.4,1.5 37.2,1.5 37.8,0.9 40.5,0.9 43,3.4 53.4,3.4 v54.3,4.3
  Bottom 0.203: v24.7,9.1 24.7,6.8 v25,6.5 | v27.4,5.4 v27.4,1.5 | v54.3,4.3 53.1,4.3 SW2.2 | v21.6,19.1 20.6,20.1 19.6,20.1 19.05,19.55 U11.1
SS  (via drill 0.38)
  Top 0.203: v35.85,6.6 35.8,6.1 35.6,5.9 34.9,5.9 33.8,4.8 33,4.8 32.3,4.1 20.9,4.1 19.7,5.3 18.1,5.3 v16,3.2 16.3,3.5
  Bottom 0.203: U3.27 v35.85,6.6 | v16,3.2 16,2.1 16.2,1.9 17.8,1.9 18,2.1 18,3.1 J7.2
SWCLK  (via drill 0.38)
  Top 0.203: v27,22.3 25.8,23.5 25.8,29.1 27.1,30.4 52.9,30.4 59.4,23.9 63.2,23.9 65,22.1 65,21.8 | SW3.1 65,21.8 | 65,21.8 62.3,21.8 61.9,21.4 61.9,19.7 62.2,19.4 62.97,19.4 J3.1
  Bottom 0.203: U3.45 30,12.25 28.3,13.95 28.3,18.9 26.4,20.8 26.4,21 26.32,21.08 | v27,22.3 26.72,22.3 26.4,21.98 26.4,21.16 26.32,21.08 | 26.32,21.08 J9.P$1
SWDIO  (via drill 0.38)
  Top 0.203: v27,23.45 26.65,23.45 26.3,23.8 26.3,28.7 27.5,29.9 46.1,29.9 55,21 SW4.1 53.9,15.5 53.7,15.7 52.4,15.7 52,15.3 52,13.6 52.2,13.4 52.97,13.4 J2.1
  Bottom 0.203: U3.46 30.1,12.75 28.7,14.15 28.7,21.75 v27,23.45 26.65,23.25 26.5,23.3 25,23.3 24.6,22.9 24.6,19.9 24.7,19.8 J10.P$1 25.59,19.9
TX_LED/IO26  (via drill 0.38)
  Top 0.203: v29.7,8.95 29.7,9.9 30.1,10.3 33.3,10.3 35,12 35,14.9 35.2,15.1 35.2,16.6 32.7,19.1 29,19.1 27.7,20.4 27.7,23.7 26.9,24.5 26.9,28.2 28.1,29.4 37.4,29.4 38.1,28.7 U8.15
  Bottom 0.203: U3.39 30,9.25 v29.7,8.95
USB_HOST_EN/IO27
  Bottom 0.203: U3.41 30,10.25 29.8,10.05 28.15,10.05 27.6,9.5 25.5,9.5 24.5,10.5 12,10.5 9.4,13.1 9.4,15.8 8.9,16.3 7.8,16.3 7.5,16.6 U5.4
USB_N
  Bottom 0.203: 32.88,7.5 U3.33 32.85,6.65 33.15,6.35 J8.2
USB_P
  Bottom 0.203: J8.3 32.5,6.3 32.35,6.45 U3.34
V_FB
  Bottom 0.203: R10.2 8.65,18.75 C14.2 8.6,19.55 R9.1 7.55,19.6 U5.3
VBATT  (via drill 0.38)
  Top 0.406: v37.7,2.4 38.25,1.85 40.15,1.85 44.2,5.9 v44.5,5.9
  Bottom 0.406: U1.3 38.11,2.86 37.8,2.55 37.8,2.4 v37.7,2.4 | Q1.C 38.42,23.78 45.7,16.5 45.7,12.2 | 45.7,12.2 64.8,12.2 65.3,12.7 J6.2 65.33,14 66.1,14 66.8,13.3 J16.P$1 | v44.5,5.9 44.65,6.05 C6.1 45.7,6.1 45.7,12.2
VCC  (via drill 0.38)
  Top 0.203: 28.5,12.85 v28.5,12.8 28.45,12.7 29.1,12.05 29.1,8.4 v29.5,8 29.4,8 | v50,8.7 50,13.4 47.2,16.2 v41.1,16.2
  Top 0.305: 41.9,25.9 42.3,25.5 U8.21 42.3,20.2 42,19.9 41.6,20.3 U8.20 41.6,25.6 41.9,25.9 | 41.9,25.9 41.9,26
  Top 0.406: v38.5,12.6 37.8,12.6 37,11.8 37,8.5 36.6,8.1 34.45,8.1 34.05,7.7 29.8,7.7 v29.5,8 23.9,8 20.6,11.3 19.7,11.3 v15.3,15.7 19.1,19.5 v19.9,19.5 | v41.9,27.45 41.9,26 | v41.1,16.2 41.1,19 42,19.9
  Bottom 0.203: U3.44 29.55,11.75 C8.1 28.5,12.7 v28.5,12.8 27.8,13.5 27.8,16.6 27.65,16.75 R7.2 25.52,17.25 J12.P$1 25.3,17.2 | U3.6 33.85,15.15 32.65,16.35 C7.1 | U3.17 38.1,11.75 38.45,12.1 38.45,12.05 v38.5,12.6 | U3.36 29.98,7.53 | 30.2,6.65 30.3,6.75 | U6.8 U6.7 | U6.3 10.34,7.06 10.2,7.2 | R1.2 50.4,8.3 v50,8.7
  Bottom 0.254: U11.6 16.13,17.45 C34.1 | U11.2 19.45,17.95 19.9,18.4 v19.9,19.5
  Bottom 0.406: v38.5,12.6 38.4,12.05 38.4,14.1 38.3,14.2 38.3,14.9 38,15.2 | C7.1 32.65,17.25 C11.1 33.9,17.6 34.5,17 U4.5 34.5,16 35.2,15.3 37.2,15.3 37.3,15.2 38,15.2 | v29.5,8 29.98,7.53 30.4,7.2 C10.1 30.3,6.75 30.3,6.6 30.25,6.6 29.65,6 28.2,6 27.8,6.3 26.9,6.3 26,5.4 24.4,5.4 24.2,5.6 21.2,5.6 20.25,4.65 J7.4 20.25,2.05 19.6,1.4 14.1,1.4 12.5,3 11.7,3 11.05,3.65 C2.1 10.2,5.15 10.2,7.2 10.2,8.6 9.2,9.61 U6.8 6.55,9.61 C16.1 | C34.1 15.73,16.47 v15.3,15.7 | J23.2 35,25.75 C19.1 34.85,25.3 35.2,25.3 35.6,24.9 R13.1 R12.1 39.8,24.9 41.9,27 v41.9,27.45 | 38,15.2 40.1,15.2 v41.1,16.2

### Text on the board
tPlace: PWR | ON | SPKR | ON
bPlace: SWC | Pocket Arcade | SWD | ASM2026 - Rev3 | BATT | RST | TinyCircuits.com | VCC | GND | SPKR
Document: FABRICATION DRAWING | NOTES: | 1. PRINTED CIRCUIT BOARD MADE FROM NEMA GRADE FR-4 EPOXY LAMINATE | WITH 1 OUNCE COPPER PLATING AND .024 THICKNESS. | 2. ALL DIMENSIONS ARE GIVEN IN INCHES. | 3. CIRCUIT PATHS ARE FOR REFERENCE ONLY. | 4. HOLE SIZES SHOWN ARE FINISHED DIAMETERS AFTER PLATING. | 5. BOARD PLATED USING REFLOW OR SIMILAR METHOD. | 6. BOARD TO HAVE BLUE SOLDER MASK ON PLATED SURFACES USING WET FILM | 7. SILKSCREEN BOARD USING WHITE INK. | SR100 OR SR1010 EPOXY. EQUIVALENT WET OR DRY FILM MAY BE USED. | 8. THE FOLLOWING INFORMATION APPLIES TO THIS BOARD: | * 2 COPPER LAYERS | * .024 BOARD THICKNESS | * REQUIRES TOP SIDE SILKSCREEN | Released under the Creative Commons Attribution Share-Alike 3.0 License | http://creativecommons.org/licenses/by-sa/3.0 | LilyPad Arduino Design by Leah Buechley and Sparkfun Electronics | Original Arduino Uno Design by Team Arduino | TinyDuino, TinyLily and TinyShield Designs by TinyCircuits | Pocket Arcade | AS-PCB-ASM2026 | 3